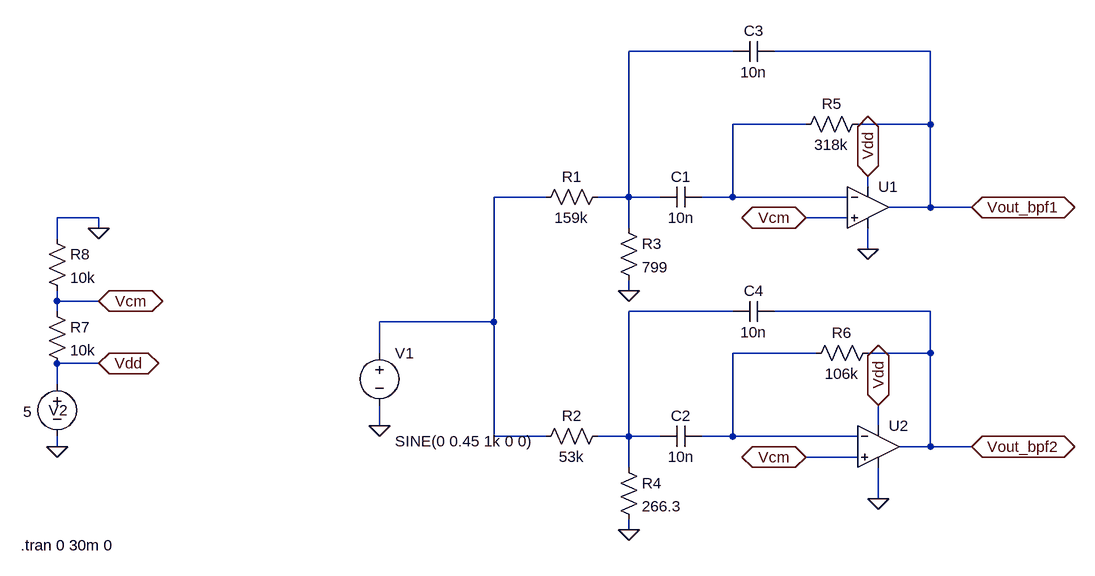
[diagram p0: schematic EE18B027_exp6 (1).asc]
EE18B027_exp6 (1).asc, the LTspice schematic file:
Version 4
SHEET 1 880 680
WIRE -176 -384 -336 -384
WIRE 128 -384 -112 -384
WIRE -64 -272 -176 -272
WIRE 128 -272 128 -384
WIRE 128 -272 16 -272
WIRE 32 -176 32 -192
WIRE -464 -160 -544 -160
WIRE -336 -160 -336 -384
WIRE -336 -160 -384 -160
WIRE -288 -160 -336 -160
WIRE -176 -160 -176 -272
WIRE -176 -160 -224 -160
WIRE 0 -160 -176 -160
WIRE 128 -144 128 -272
WIRE 128 -144 64 -144
WIRE 192 -144 128 -144
WIRE -1152 -128 -1216 -128
WIRE 0 -128 -64 -128
WIRE -1152 -112 -1152 -128
WIRE -336 -112 -336 -160
WIRE -1216 -96 -1216 -128
WIRE 32 -80 32 -112
WIRE -336 -16 -336 -32
WIRE -1216 0 -1216 -16
WIRE -1152 0 -1216 0
WIRE -1216 16 -1216 0
WIRE -176 16 -336 16
WIRE 128 16 -112 16
WIRE -544 32 -544 -160
WIRE -544 32 -720 32
WIRE -720 80 -720 32
WIRE -48 80 -176 80
WIRE 128 80 128 16
WIRE 128 80 32 80
WIRE -1152 96 -1216 96
WIRE -1216 128 -1216 96
WIRE -720 192 -720 160
WIRE 48 192 48 160
WIRE -544 208 -544 32
WIRE -464 208 -544 208
WIRE -336 208 -336 16
WIRE -336 208 -384 208
WIRE -288 208 -336 208
WIRE -176 208 -176 80
WIRE -176 208 -224 208
WIRE 16 208 -176 208
WIRE -1216 224 -1216 208
WIRE 128 224 128 80
WIRE 128 224 80 224
WIRE 192 224 128 224
WIRE 16 240 -64 240
WIRE -336 256 -336 208
WIRE 48 304 48 256
WIRE -336 352 -336 336
FLAG -336 -16 0
FLAG -336 352 0
FLAG -720 192 0
FLAG -1216 224 0
FLAG -1152 -112 0
FLAG -1152 96 Vdd
IOPIN -1152 96 BiDir
FLAG -1152 0 Vcm
IOPIN -1152 0 BiDir
FLAG -64 -128 Vcm
IOPIN -64 -128 BiDir
FLAG -64 240 Vcm
IOPIN -64 240 BiDir
FLAG 48 304 0
FLAG 32 -80 0
FLAG 32 -192 Vdd
IOPIN 32 -192 BiDir
FLAG 48 160 Vdd
IOPIN 48 160 BiDir
FLAG 192 -144 Vout_bpf1
IOPIN 192 -144 BiDir
FLAG 192 224 Vout_bpf2
IOPIN 192 224 BiDir
SYMBOL res -368 -176 R90
WINDOW 0 0 56 VBottom 2
WINDOW 3 32 56 VTop 2
SYMATTR InstName R1
SYMATTR Value 159k
SYMBOL res -368 192 R90
WINDOW 0 0 56 VBottom 2
WINDOW 3 32 56 VTop 2
SYMATTR InstName R2
SYMATTR Value 53k
SYMBOL cap -224 -176 R90
WINDOW 0 0 32 VBottom 2
WINDOW 3 32 32 VTop 2
SYMATTR InstName C1
SYMATTR Value 10n
SYMBOL res -352 -128 R0
SYMATTR InstName R3
SYMATTR Value 799
SYMBOL res -352 240 R0
SYMATTR InstName R4
SYMATTR Value 266.3
SYMBOL cap -224 192 R90
WINDOW 0 0 32 VBottom 2
WINDOW 3 32 32 VTop 2
SYMATTR InstName C2
SYMATTR Value 10n
SYMBOL Opamps\\UniversalOpamp2 32 -144 R0
SYMATTR InstName U1
SYMBOL Opamps\\UniversalOpamp2 48 224 R0
SYMATTR InstName U2
SYMBOL res 32 -288 R90
WINDOW 0 0 56 VBottom 2
WINDOW 3 32 56 VTop 2
SYMATTR InstName R5
SYMATTR Value 318k
SYMBOL res 48 64 R90
WINDOW 0 0 56 VBottom 2
WINDOW 3 32 56 VTop 2
SYMATTR InstName R6
SYMATTR Value 106k
SYMBOL cap -112 -400 R90
WINDOW 0 0 32 VBottom 2
WINDOW 3 32 32 VTop 2
SYMATTR InstName C3
SYMATTR Value 10n
SYMBOL cap -112 0 R90
WINDOW 0 0 32 VBottom 2
WINDOW 3 32 32 VTop 2
SYMATTR InstName C4
SYMATTR Value 10n
SYMBOL voltage -1216 112 R0
WINDOW 0 -13 56 Left 2
WINDOW 3 -52 58 Left 2
WINDOW 123 0 0 Left 0
WINDOW 39 0 0 Left 0
SYMATTR InstName V2
SYMATTR Value 5
SYMBOL res -1232 0 R0
SYMATTR InstName R7
SYMATTR Value 10k
SYMBOL res -1232 -112 R0
SYMATTR InstName R8
SYMATTR Value 10k
SYMBOL voltage -720 64 R0
WINDOW 123 24 124 Left 2
WINDOW 39 0 0 Left 0
WINDOW 3 24 152 Left 2
SYMATTR InstName V1
SYMATTR Value SINE(0 0.45 1k 0 0)
TEXT -1272 376 Left 2 !.tran 0 30m 0

The netlist it stands for:
* EE18B027_exp6 (1).asc
R1 N001 N003 159k
R2 N004 N003 53k
C1 N002 N001 10n
R3 N001 0 799
R4 N004 0 266.3
C2 N005 N004 10n
XU1 Vcm N002 Vdd 0 Vout_bpf1 level.2 Avol=1Meg GBW=10Meg Slew=10Meg ilimit=25m rail=0 Vos=0 phimargin=45 en=0 enk=0 in=0 ink=0 Rin=500Meg  ; pins IN+ IN- V+ V- OUT
XU2 Vcm N005 Vdd 0 Vout_bpf2 level.2 Avol=1Meg GBW=10Meg Slew=10Meg ilimit=25m rail=0 Vos=0 phimargin=45 en=0 enk=0 in=0 ink=0 Rin=500Meg  ; pins IN+ IN- V+ V- OUT
R5 Vout_bpf1 N002 318k
R6 Vout_bpf2 N005 106k
C3 Vout_bpf1 N001 10n
C4 Vout_bpf2 N004 10n
V2 Vdd 0 5
R7 Vcm Vdd 10k
R8 0 Vcm 10k
V1 N003 0 SINE(0 0.45 1k 0 0)
.tran 0 30m 0
.lib UniversalOpamps2.sub
.backanno
.end